# Altium project energy_harvesting_board.PrjPcb
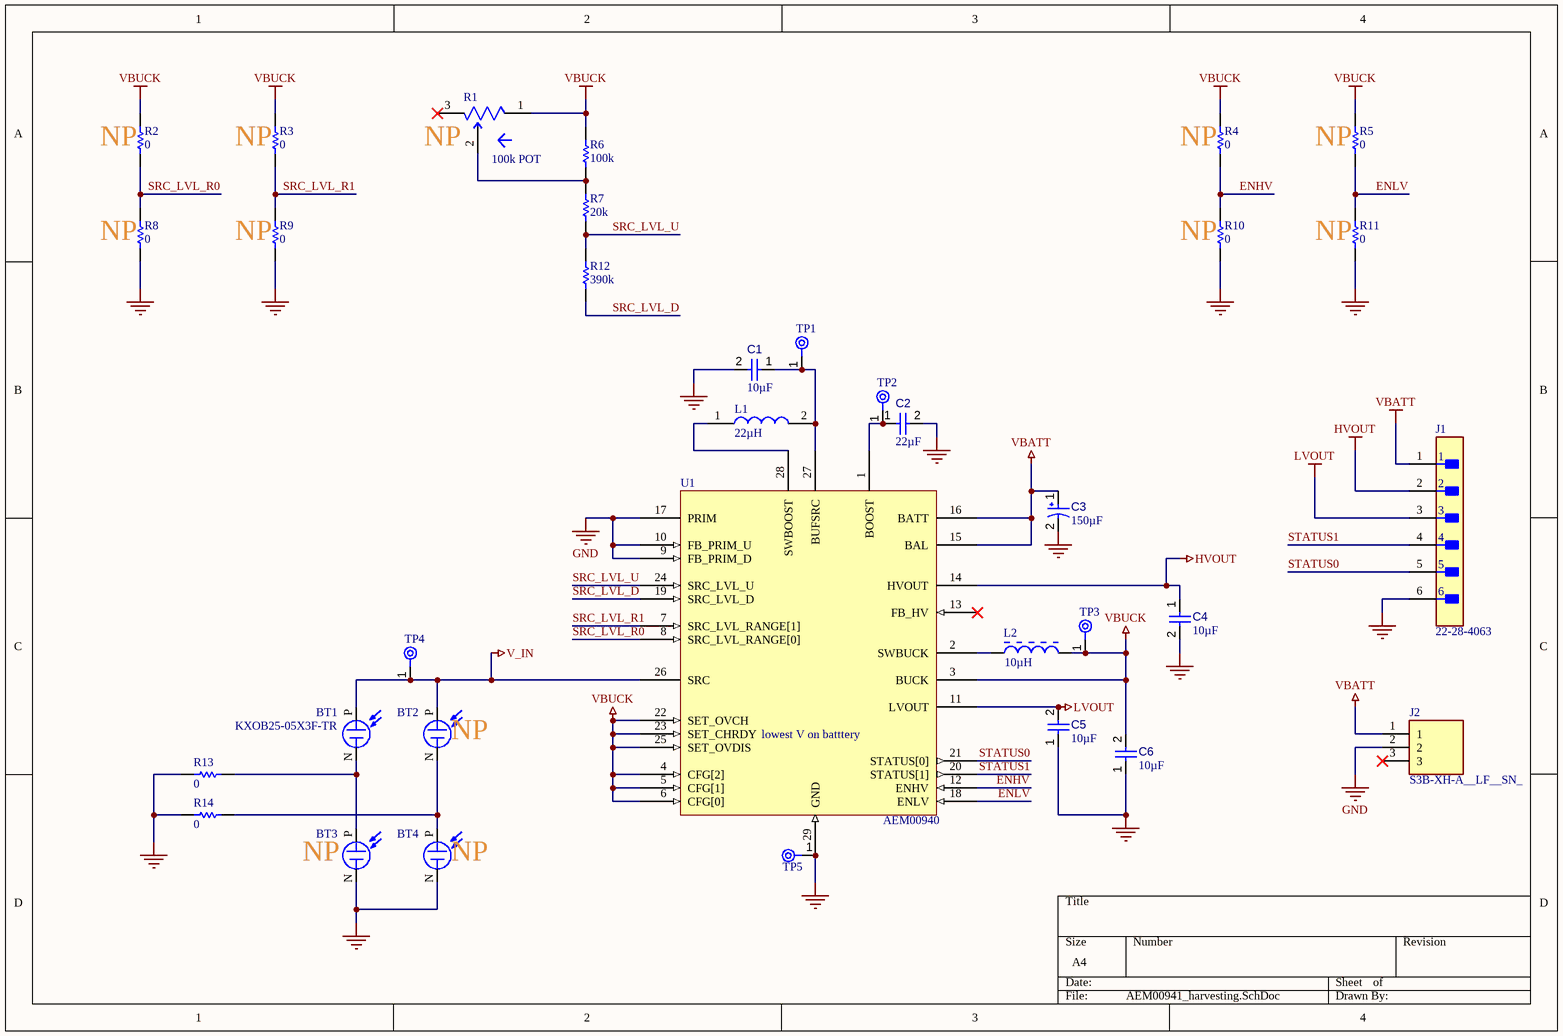
[diagram p0: AEM00941_harvesting.SchDoc]
1 sheet, 34 parts. Net scope: global (net labels, ports and power ports of the same name join across sheets).
Board file: PCB1.PcbDoc

## Sheet AEM00941_harvesting.SchDoc
size A4; SheetNumber: 1; SheetTotal: 1

### Parts
BT1  KXOB25-05X3F-TR  [SOLAR_KXOB25-14X1F-TR]
BT2  KXOB25-05X3F-TR  [SOLAR_KXOB25-14X1F-TR]  (value not drawn)
BT3  KXOB25-05X3F-TR  [SOLAR_KXOB25-14X1F-TR]  (value not drawn)
BT4  KXOB25-05X3F-TR  [SOLAR_KXOB25-14X1F-TR]  (value not drawn)
C1  value 10µF  [CAPC0603(1608)100_L]  (hidden comment: Capacitor 10µF +/-20% 10V 0603)
C2  value 22µF  [CAPC0603(1608)100_L]  (hidden comment: Capacitor 10µF +/-20% 10V 0603)
C3  value 150µF  [AVX-TAJ-B-2_L]  (hidden comment: TAJB106K016RNJ)
C4  value 10µF  [CAPC0603(1608)100_L]  (hidden comment: Capacitor 10µF +/-20% 10V 0603)
C5  value 10µF  [CAPC0603(1608)100_L]  (hidden comment: Capacitor 10µF +/-20% 10V 0603)
C6  value 10µF  [CAPC0603(1608)100_L]  (hidden comment: Capacitor 10µF +/-20% 10V 0603)
J1  22-28-4063  [FP-22-28-4063-MFG]
J2  S3B-XH-A__LF__SN_  [SHDRRA3W64P0X250_1X3_990X1150X610P]
L1  22µH  [LPS4018223MRC]
L2  10µH  [MURA-BLM18-F-H1-CHIP-2_V]
R1  100k POT  [FP-PV36W-MFG]
R2  value 0  [RESC1005X40X25ML05T10]  (hidden comment: Resistor 0R 0402 63 mW)
R3  value 0  [RESC1005X40X25ML05T10]  (hidden comment: Resistor 0R 0402 63 mW)
R4  value 0  [RESC1005X40X25ML05T10]  (hidden comment: Resistor 0R 0402 63 mW)
R5  value 0  [RESC1005X40X25ML05T10]  (hidden comment: Resistor 0R 0402 63 mW)
R6  value 100k  [RESC1608X55X25ML10T15]  (hidden comment: Resistor 0R +/- 5% 0603 100 mW)
R7  value 20k  [RESC1608X55X25ML10T15]  (hidden comment: Resistor 0R +/- 5% 0603 100 mW)
R8  value 0  [RESC1005X40X25ML05T10]  (hidden comment: Resistor 0R 0402 63 mW)
R9  value 0  [RESC1005X40X25ML05T10]  (hidden comment: Resistor 0R 0402 63 mW)
R10  value 0  [RESC1005X40X25ML05T10]  (hidden comment: Resistor 0R 0402 63 mW)
R11  value 0  [RESC1005X40X25ML05T10]  (hidden comment: Resistor 0R 0402 63 mW)
R12  value 390k  [RESC1608X55X25ML10T15]  (hidden comment: Resistor 0R +/- 5% 0603 100 mW)
R13  value 0  [RESC1005X40X25ML05T10]  (hidden comment: Resistor 0R 0402 63 mW)
R14  value 0  [RESC1005X40X25ML05T10]  (hidden comment: Resistor 0R 0402 63 mW)
TP1  TPAD6R  [TP06R]  (value not drawn)  (no BOM)
TP2  TPAD6R  [TP06R]  (value not drawn)  (no BOM)
TP3  TPAD6R  [TP06R]  (value not drawn)  (no BOM)
TP4  TPAD6R  [TP06R]  (value not drawn)  (no BOM)
TP5  TPAD6R  [TP06R]  (value not drawn)  (no BOM)
U1  AEM00940  [QFN40P400X400X85_HS-29N]

### Nets
GND: BT3.N BT4.N C1.2 C2.2 C3.2 C4.2 C5.1 C6.1 J1.6 J2.2 R8.1 R9.1 R10.1 R11.1 R13.2 R14.2 TP5.1(TP) U1.9(FB_PRIM_D) U1.10(FB_PRIM_U) U1.17(PRIM) U1.29(GND)
HVOUT: C4.1 J1.2 U1.14(HVOUT)
LVOUT: C5.2 J1.3 U1.11(LVOUT)
V_IN: BT1.P BT2.P TP4.1(TP) U1.26(SRC)
VBATT: C3.1 J1.1 J2.1 U1.15(BAL) U1.16(BATT)
VBUCK: C6.2 L2.2 R1.1 R2.2 R3.2 R4.2 R5.2 R6.2 TP3.1(TP) U1.3(BUCK) U1.4(CFG[2]) U1.5(CFG[1]) U1.6(CFG[0]) U1.22(SET_OVCH) U1.23(SET_CHRDY) U1.25(SET_OVDIS)
ENHV: R4.1 R10.2 U1.12(ENHV)
ENLV: R5.1 R11.2 U1.18(ENLV)
SRC_LVL_D: R12.1 U1.19(SRC_LVL_D)
SRC_LVL_R0: R2.1 R8.2 U1.8(SRC_LVL_RANGE[0])
SRC_LVL_R1: R3.1 R9.2 U1.7(SRC_LVL_RANGE[1])
SRC_LVL_U: R7.1 R12.2 U1.24(SRC_LVL_U)
STATUS0: J1.5 U1.21(STATUS[0])
STATUS1: J1.4 U1.20(STATUS[1])
NetBT1_N: BT1.N BT3.P R13.1
NetBT2_N: BT2.N BT4.P R14.1
NetC1_1: C1.1 L1.2 TP1.1(TP) U1.27(BUFSRC)
NetC2_1: C2.1 TP2.1(TP) U1.1(BOOST)
NetL1_1: L1.1 U1.28(SWBOOST)
NetL2_1: L2.1 U1.2(SWBUCK)
NetR1_2: R1.2(Wiper) R6.1 R7.2

Not connected (* = marked no-connect by the designer): J2 3*; R1 3*; U1 13(FB_HV)*

### Notes on the sheet
- (near R2) NP
- (near R3) NP
- (near R1) NP
- (near R4) NP
- (near R5) NP
- (near R8) NP
- (near R9) NP
- (near R10) NP
- (near R11) NP
- (near BT2) NP
- (near U1) lowest V on batttery
- (near BT3) NP
- (near BT4) NP

### Library data of the parts
BT1-BT4 = KXOB25-14X1F-TR: Monocrystalline Solar Cell 30.7 mW 690 mV; MF: ANYSOLAR Ltd; SnapEDA_Link: https://www.snapeda.com/parts/KXOB25-14X1F-TR/Sola/view-part/?ref=snap; Package: None; Value: *; MP: KXOB25-14X1F-TR; Check_prices: https://www.snapeda.com/parts/KXOB25-14X1F-TR/Sola/view-part/?ref=eda
C1 C2 C4-C6 = CMP-001-00075-4: Chip Capacitor, 10µF +/-20%, 10V, 0603, Thickness 1 mm; Tolerance: 10%; Voltage Rating: 10V; Max Operating Temperature: 85°C; Pins: 2; Case/Package: 0603; Mounting Technology: SMT; Min Operating Temperature: -55°C
C3 = CMP-001-00043-7: Standard Tantalum, 10 uF, +/- 10%, 16 V, -55 to 125 degC, 1210 (3528 Metric), RoHS, Tape and Reel; Manufacturer: AVX; ESR: 2.8Ohm; Voltage Rating: 16V; RoHS Compliant: True; Capacitor Type: Tantalum; Manufacturer URL: http://www.avx.com/; Pins: 2; Case/Package: 1210; Package Quantity: 2000; Package Description: 2-Pin Surface Mount Device, Body 3.5 x 2.85 mm; Max Operating Temperature: 125°C; Packaging: TapeandReel; Datasheet URL: http://datasheets.avx.com/TAJ.pdf; Tolerance: 10%; Mounting Technology: SM; Datasheet Version: Feb-16; Package Reference: TAJ-B-2; Resistance: 2.8Ohm; Min Operating Temperature: -55°C
J1 = CMP-04776-000885-1: CONN HEADER VERT 6POS 2.54MM; Number of Circuits: 6; Voltage Rating (DC): 250V; Connector Type: Male Pin; Contact Resistance: 20mR; Glow Wire Compliant: Non-compliant; Gender: Male; Current Rating: 4A; Max Voltage Rating (DC): 250.25kV; Series: KK® 42375; Termination: Solder; Orientation: Straight; Max Operating Temperature: 75°C; Min Operating Temperature: 0°C; Mount: Through Hole; Depth: 2.49mm; Contact Material: Brass; Number of Positions: 6; Contact Mating Length: 0.24inch; Number of Rows: 1; Housing Color: Black; Max Voltage Rating (AC): 250V; Housing Material: Thermoplastic; Packaging: Bulk; Contact Plating: Gold; Contact Type: Male Pin; Package Quantity: 1; Number of Contacts: 6; Voltage Rating: 250V; Lead Free: Lead Free; RoHS Compliant: Yes; Pitch: 2.54mm; Color: Black; Flammability Rating: UL94 V-0; Radiation Hardening: No
J2 = S3B-XH-A__LF__SN_: Connector; Manufacturer_Name: JST (JAPAN SOLDERLESS TERMINALS); Manufacturer_Part_Number: S3B-XH-A (LF)(SN); Datasheet Link: http://www.farnell.com/datasheets/2057209.pdf; Height: 6.1mm
L1 = LPS4018-223MRC: Inductor; Manufacturer_Name: COILCRAFT; Datasheet Link: https://www.coilcraft.com/pdfs/lps4018.pdf; Height: 1.8mm; Manufacturer_Part_Number: LPS4018-223MRC; Mouser Part Number: 994-LPS4018-223MRC; Mouser Price/Stock: https://www.mouser.co.uk/ProductDetail/Coilcraft/LPS4018-223MRC?qs=QQJxVsr8EGZ1iTyTHMP0jg%3D%3D
L2 = CMP-006-00004-3: Chip Ferrite Bead for General Use, 120 Ohm, 500 mA, -55 to 125 degC, 0603 (1608 Metric), RoHS, Tape and Reel; Manufacturer: Murata; Max Current Rating: 500mA; Tolerance: 25%; Impedance: 120Ohm; Resistance: 200mohm; Min Operating Temperature: -55°C; Package Reference: BLM18_H950-2; Max Operating Temperature: 125°C; Current Rating: 500mA; Core Material: Ferrite; Datasheet Version: Jun-12; Packaging: TapeandReel; Datasheet URL: https://statics3.seeedstudio.com/images/opl/datasheet/303010016.pdf; Package Quantity: 4000; Case/Package: 0603; RoHS Compliant: True
R1 = CMP-07234-000009-1: TRIMMER 1K OHM 0.5W PC PIN TOP; Manufacturer Part Number: PV36W102C01B00; Manufacturer: Bourns; Temperature Coefficient: 100ppm/°C; Standoff Height: 0.38mm; Resistance: 1kΩ; Tolerance: 10%; Value: 1kΩ; Octopart: https://octopart.com/pv36w102c01b00-bourns-71612321; ComponentLink2URL: https://www.bourns.com/docs/Product-Datasheets/pv36.pdf; Category: Res; RoHS: TRUE; Device Class L1: Passive Components; Height: 12.05mm; ComponentLink2Description: Datasheet; Mouser Description: Trimmer Resistors - Through Hole 1.0Kohms 10mm Square 25turn; Package: PV36W; Device Class L2: Resistors; Power Rating: 0.5W; Digikey Description: TRIMMER 1K OHM 0.5W PC PIN TOP; Automotive: No; Temperature Range High: +125°C; Series: PV36; Temperature Range Low: -55°C; Temperature: -55°C to +125°C; Device Class L3: Variable Resistors and Potentiometers; Composition: Cermet; Lead Free: Yes
R2-R5 R8-R11 R13 R14 = CMP-009-00004-5: Chip Resistor, 0 Ohm, 0.063 W, -55 to 155 degC, 0402 (1005 Metric); Power: 63mW; Voltage Rating: 50V; Max Operating Temperature: 155°C; Pins: 2; RoHS Compliant: True; Min Operating Temperature: -55°C; Mounting Technology: SM; Case/Package: 0402
R6 R7 R12 = CMP-009-00006-5: Chip Resistor, 0 Ohm, 0.1 W, -55 to 155 degC, 0603 (1608 Metric); Power: 100mW; Voltage Rating: 50V; Max Operating Temperature: 155°C; RoHS Compliant: True; Mounting Technology: SM; Case/Package: 0603; Min Operating Temperature: -55°C; Tolerance: 5%; Pins: 2
TP1-TP5 = CMP-00028-00002-2: 0.6mm round; Pins: 1
U1 = AEM00941